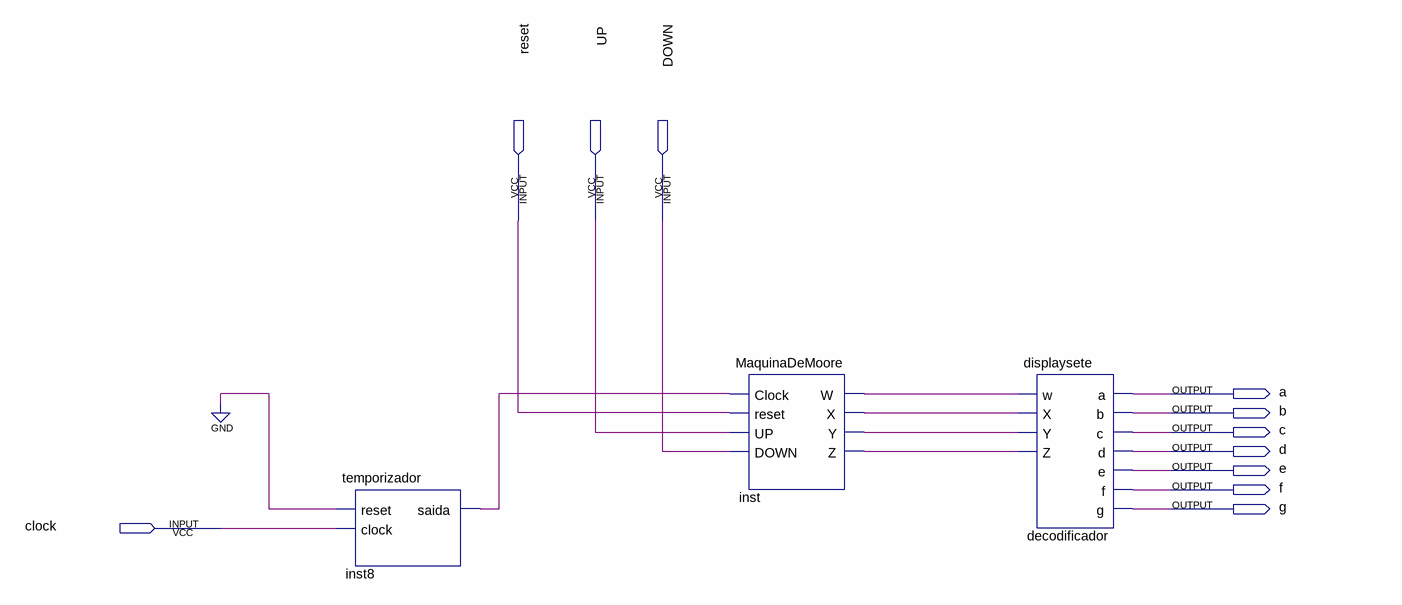
[diagram p0: schematic sheet]
// Quartus schematic contdec.bdf as structural Verilog: 3 symbols, 11 pins
module contdec (
  input  reset,
  input  UP,
  input  DOWN,
  input  clock,
  output a,
  output b,
  output c,
  output d,
  output e,
  output f,
  output g
);

  wire inst8_saida, inst_w, inst_x, inst_y, inst_z;

  temporizador inst8 (.reset(1'b0), .clock(clock), .saida(inst8_saida));
  MaquinaDeMoore inst (
    .Clock(inst8_saida), .reset(reset), .UP(UP), .DOWN(DOWN), .W(inst_w), .X(inst_x), .Y(inst_y), .Z(inst_z));
  displaysete decodificador (
    .w(inst_w), .X(inst_x), .Y(inst_y), .Z(inst_z), .a(a), .b(b), .c(c), .d(d), .e(e), .f(f), .g(g));
endmodule
